# Altium schematic sheet S3_CHAIR_SPKR-AMP+SPK.SchDoc
size 431 x 279 mm; Revision: 1-0; SheetNumber: 4; SheetTotal: 4; CustomerName: PLASTIMOLD; ProjectName: Chairspeaker TI Receiver
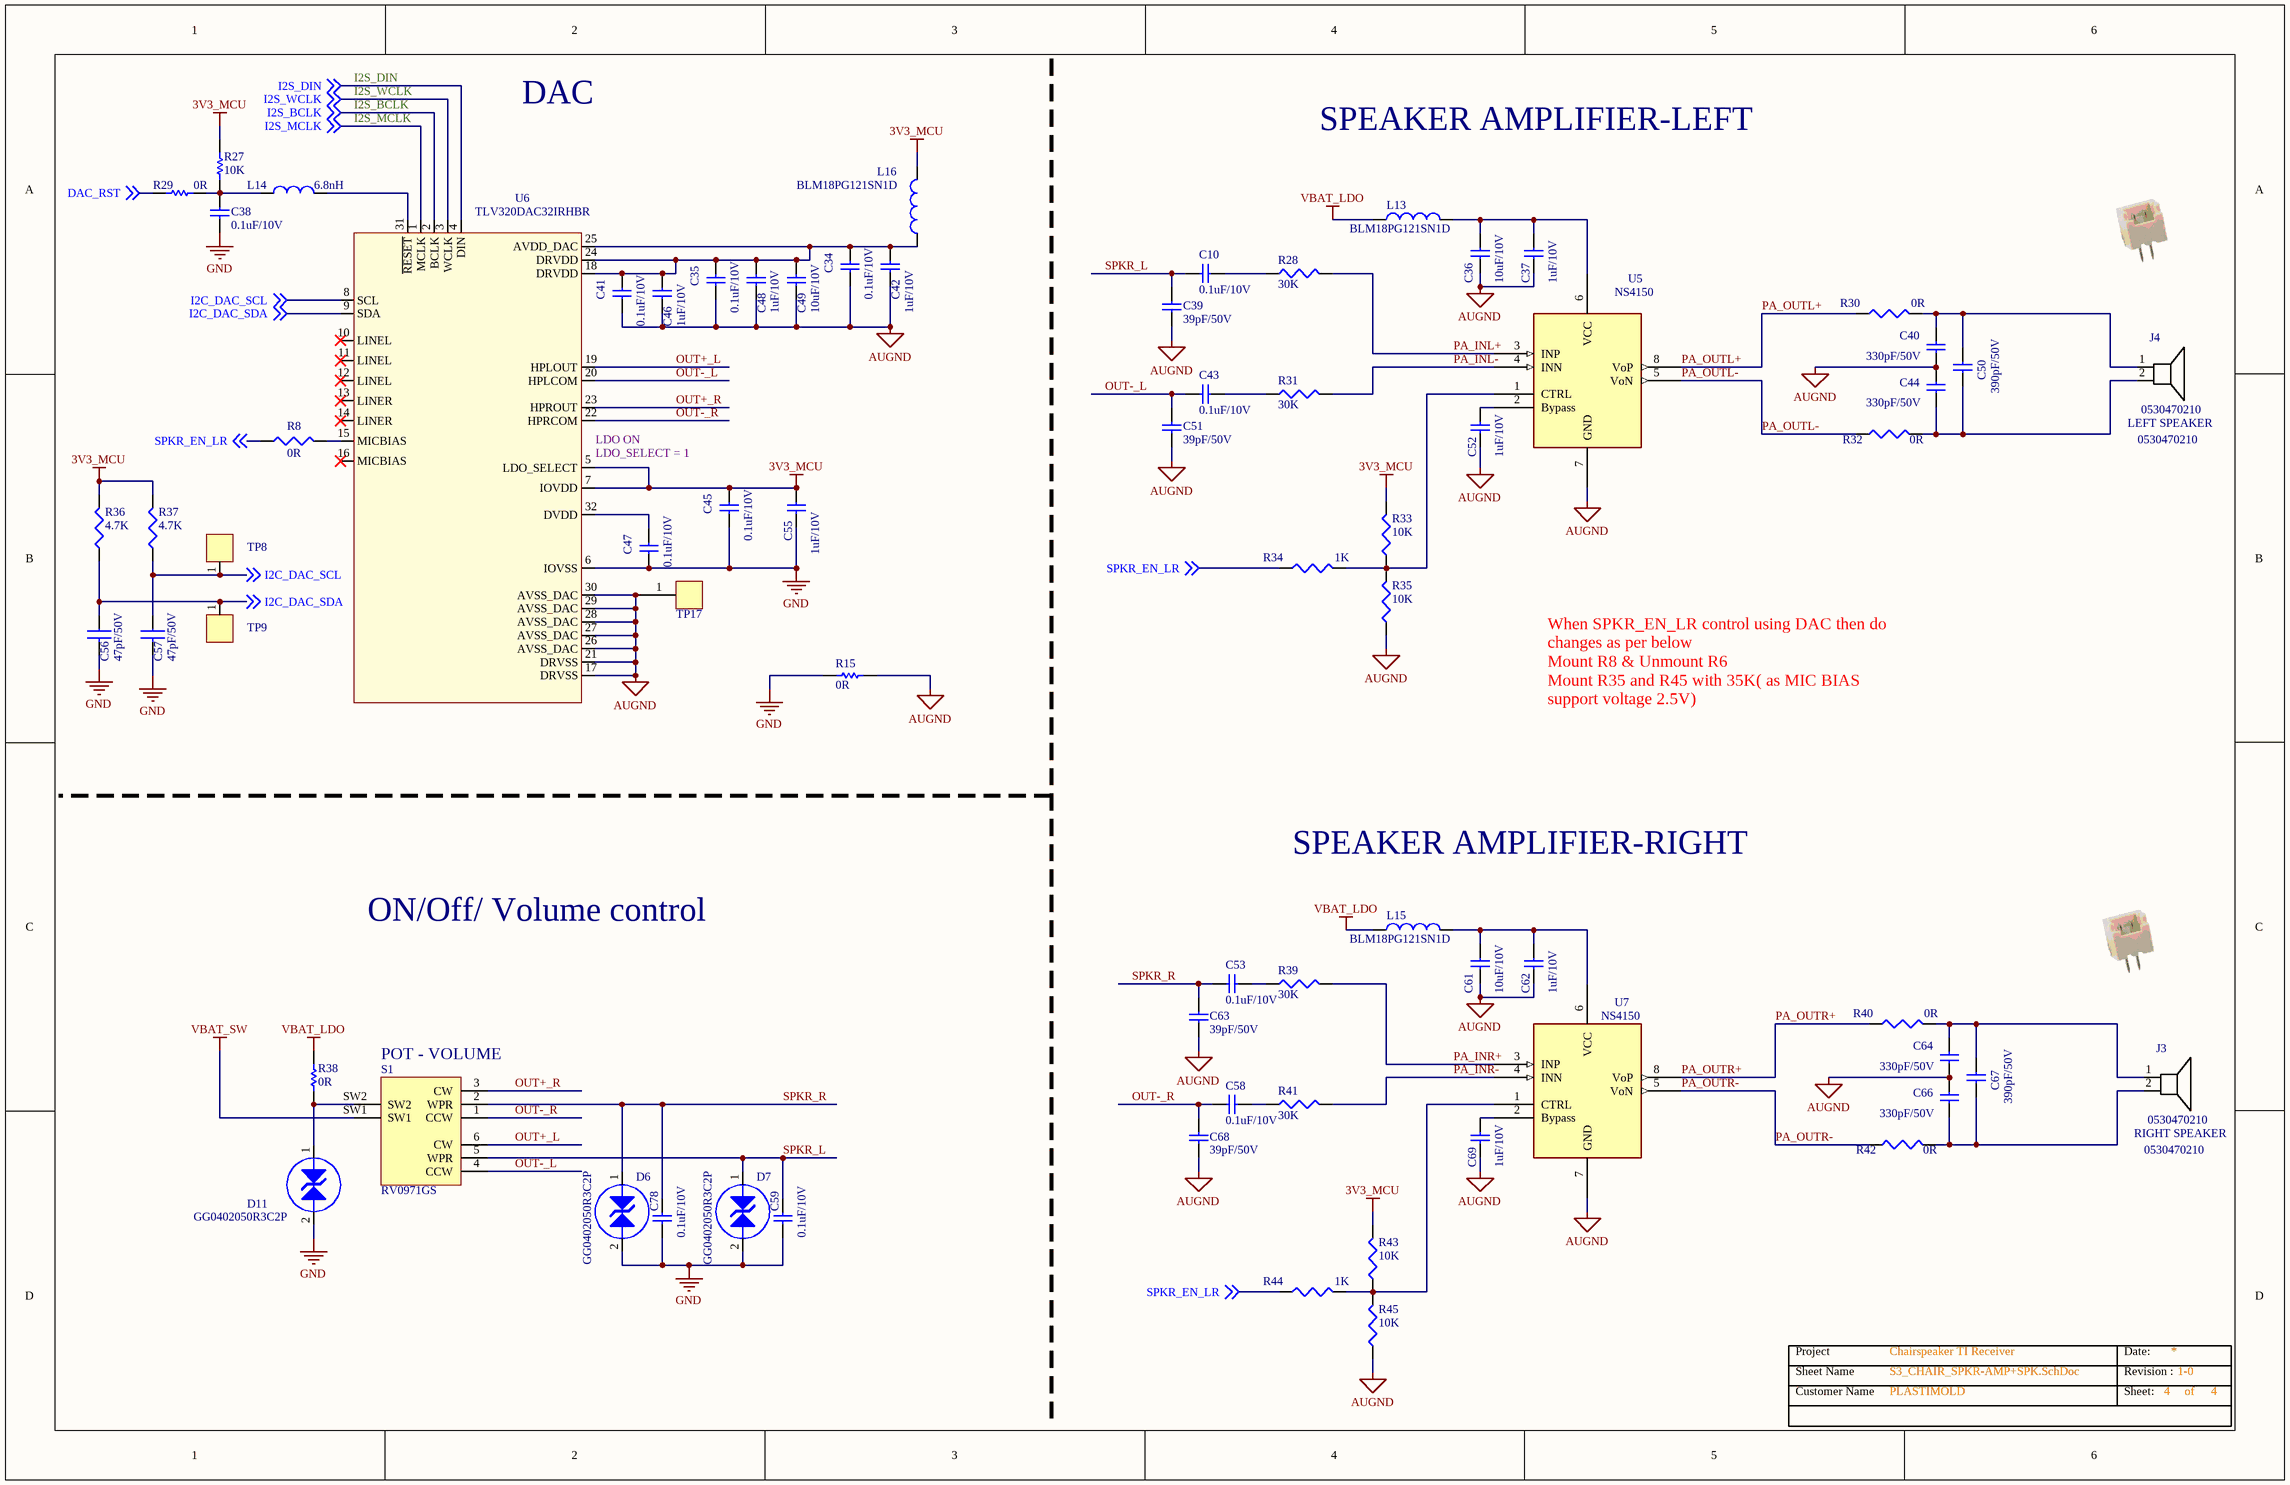
[diagram p0: S3_CHAIR_SPKR-AMP+SPK.SchDoc]

## Parts
C10  0.1uF/10V  [CAP_0402_(M1005)]
C34  0.1uF/10V  [CAP_0402_(M1005)]
C35  0.1uF/10V  [CAP_0402_(M1005)]
C36  10uF/10V  [CAP_0805_(M2012)]
C37  1uF/10V  [CAP_0402_(M1005)]
C38  0.1uF/10V  [CAP_0402_(M1005)]
C39  39pF/50V  [CAP_0402_(M1005)]
C40  330pF/50V  [CAP_0402_(M1005)]
C41  0.1uF/10V  [CAP_0402_(M1005)]
C42  1uF/10V  [CAP_0402_(M1005)]
C43  0.1uF/10V  [CAP_0402_(M1005)]
C44  330pF/50V  [CAP_0402_(M1005)]
C45  0.1uF/10V  [CAP_0402_(M1005)]
C46  1uF/10V  [CAP_0402_(M1005)]
C47  0.1uF/10V  [CAP_0402_(M1005)]
C48  1uF/10V  [CAP_0402_(M1005)]
C49  10uF/10V  [CAP_0805_(M2012)]
C50  390pF/50V  [CAP_0402_(M1005)]
C51  39pF/50V  [CAP_0402_(M1005)]
C52  1uF/10V  [CAP_0402_(M1005)]
C53  0.1uF/10V  [CAP_0402_(M1005)]
C55  1uF/10V  [CAP_0402_(M1005)]
C56  47pF/50V  [CAP_0402_(M1005)]
C57  47pF/50V  [CAP_0402_(M1005)]
C58  0.1uF/10V  [CAP_0402_(M1005)]
C59  0.1uF/10V  [CAP_0402_(M1005)]
C61  10uF/10V  [CAP_0805_(M2012)]
C62  1uF/10V  [CAP_0402_(M1005)]
C63  39pF/50V  [CAP_0402_(M1005)]
C64  330pF/50V  [CAP_0402_(M1005)]
C66  330pF/50V  [CAP_0402_(M1005)]
C67  390pF/50V  [CAP_0402_(M1005)]
C68  39pF/50V  [CAP_0402_(M1005)]
C69  1uF/10V  [CAP_0402_(M1005)]
C78  0.1uF/10V  [CAP_0402_(M1005)]
D6  GG0402050R3C2P  [TVS_0402_(M1005)_BI-DIRECTIONAL]
D7  GG0402050R3C2P  [TVS_0402_(M1005)_BI-DIRECTIONAL]
D11  GG0402050R3C2P  [TVS_0402_(M1005)_BI-DIRECTIONAL]
J3  0530470210  [0530470210]
J4  0530470210  [0530470210]
L13  value BLM18PG121SN1D  [IND_0603_(M1608)]  (hidden comment: BLM18PG181SN1D)
L14  6.8nH  [IND_0402_(M1005)]
L15  value BLM18PG121SN1D  [IND_0603_(M1608)]  (hidden comment: BLM18PG181SN1D)
L16  value BLM18PG121SN1D  [IND_0603_(M1608)]  (hidden comment: BLM18PG181SN1D)
R8  0R  [RES_0402_(M1005)]
R15  0R  [RES_0402_(M1005)]
R27  10K  [RES_0402_(M1005)]
R28  30K  [RES_0402_(M1005)]
R29  0R  [RES_0402_(M1005)]
R30  0R  [RES_0402_(M1005)]
R31  30K  [RES_0402_(M1005)]
R32  0R  [RES_0402_(M1005)]
R33  10K  [RES_0402_(M1005)]
R34  1K  [RES_0402_(M1005)]
R35  10K  [RES_0402_(M1005)]
R36  4.7K  [RES_0402_(M1005)]
R37  4.7K  [RES_0402_(M1005)]
R38  0R  [RES_0402_(M1005)]
R39  30K  [RES_0402_(M1005)]
R40  0R  [RES_0402_(M1005)]
R41  30K  [RES_0402_(M1005)]
R42  0R  [RES_0402_(M1005)]
R43  10K  [RES_0402_(M1005)]
R44  1K  [RES_0402_(M1005)]
R45  10K  [RES_0402_(M1005)]
S1  RV0971GS  [RV0971GS]
TP8  TP  [TestP SM 30MIL ROUND]  (value not drawn)  (no BOM)
TP9  TP  [TestP SM 30MIL ROUND]  (value not drawn)  (no BOM)
TP17  TP  [TestP SM 30MIL ROUND]  (value not drawn)  (no BOM)
U5  NS4150  [SOP-8]
U6  TLV320DAC32IRHBR  [VQFN32]
U7  NS4150  [SOP-8]

## Nets
3V3_MCU: C45.2 C55.2 L16.2 R27.1 R33.2 R36.2 R37.2 R43.2 U6.5(LDO_SELECT) U6.7(IOVDD)
AUGND: C34.1 C35.1 C36.1 C37.1 C39.1 C40.1 C41.1 C42.1 C44.2 C46.1 C48.1 C49.1 C51.1 C52.1 C61.1 C62.1 C63.1 C64.1 C66.2 C68.1 C69.1 R15.1 R35.1 R45.1 TP17.1 U5.7(GND) U6.17(DRVSS) U6.21(DRVSS) U6.26(AVSS_DAC) U6.27(AVSS_DAC) U6.28(AVSS_DAC) U6.29(AVSS_DAC) U6.30(AVSS_DAC) U7.7(GND)
GND: C38.1 C45.1 C47.1 C55.1 C56.2 C57.2 C59.1 C78.1 D6.2 D7.2 D11.2 R15.2 U6.6(IOVSS)
VBAT_LDO: L13.1 L15.1 R38.2
VBAT_SW: S1.SW1
DAC_RST: R29.1 ; off-sheet DAC_RST
I2C_DAC_SCL: C57.1 R37.1 TP8.1 U6.8(SCL) ; off-sheet I2C_DAC_SCL
I2C_DAC_SDA: C56.1 R36.1 TP9.1 U6.9(SDA) ; off-sheet I2C_DAC_SDA
I2S_BCLK: U6.2(BCLK) ; off-sheet I2S_BCLK
I2S_DIN: U6.4(DIN) ; off-sheet I2S_DIN
I2S_MCLK: U6.1(MCLK) ; off-sheet I2S_MCLK
I2S_WCLK: U6.3(WCLK) ; off-sheet I2S_WCLK
OUT+_L: S1.6(CW) U6.19(HPLOUT)
OUT+_R: S1.3(CW) U6.23(HPROUT)
OUT-_L: C43.1 C51.2 S1.4(CCW) U6.20(HPLCOM)
OUT-_R: C58.1 C68.2 S1.1(CCW) U6.22(HPRCOM)
PA_INL+: R28.1 U5.3(INP)
PA_INL-: R31.1 U5.4(INN)
PA_INR+: R39.1 U7.3(INP)
PA_INR-: R41.1 U7.4(INN)
PA_OUTL+: R30.1 U5.8(VoP)
PA_OUTL-: R32.1 U5.5(VoN)
PA_OUTR+: R40.1 U7.8(VoP)
PA_OUTR-: R42.1 U7.5(VoN)
SPKR_EN_LR: R8.1 R34.1 R44.1 ; off-sheet SPKR_EN_LR
SPKR_L: C10.1 C39.2 C59.2 D7.1 S1.5(WPR)
SPKR_R: C53.1 C63.2 C78.2 D6.1 S1.2(WPR)
NetC10_2: C10.2 R28.2
NetC34_2: C34.2 C35.2 C41.2 C42.2 C46.2 C48.2 C49.2 L16.1 U6.18(DRVDD) U6.24(DRVDD) U6.25(AVDD_DAC)
NetC36_2: C36.2 C37.2 L13.2 U5.6(VCC)
NetC38_2: C38.2 L14.1 R27.2 R29.2
NetC40_2: C40.2 C50.2 J4.1(POS) R30.2
NetC43_2: C43.2 R31.2
NetC44_1: C44.1 C50.1 J4.2(NEG) R32.2
NetC47_2: C47.2 U6.32(DVDD)
NetC52_2: C52.2 U5.2(Bypass)
NetC53_2: C53.2 R39.2
NetC58_2: C58.2 R41.2
NetC61_2: C61.2 C62.2 L15.2 U7.6(VCC)
NetC64_2: C64.2 C67.2 J3.1(POS) R40.2
NetC66_1: C66.1 C67.1 J3.2(NEG) R42.2
NetC69_2: C69.2 U7.2(Bypass)
NetD11_1: D11.1 R38.1 S1.SW2
NetL14_2: L14.2 U6.31(~{RESET})
NetR8_2: R8.2 U6.15(MICBIAS)
NetR33_1: R33.1 R34.2 R35.2 U5.1(CTRL)
NetR43_1: R43.1 R44.2 R45.2 U7.1(CTRL)

Not connected (* = marked no-connect by the designer): U6 10(LINEL)* 11(LINEL)* 12(LINEL)* 13(LINER)* 14(LINER)* 16(MICBIAS)*

## Notes on the sheet
- DAC
- SPEAKER AMPLIFIER-LEFT
- (near J4) LEFT SPEAKER
- (near U6) LDO ON
- (near U6) LDO_SELECT = 1
- When SPKR_EN_LR control using DAC then do changes as per below
  Mount R8 & Unmount R6
  Mount R35 and R45 with 35K( as MIC BIAS support voltage 2.5V)
- SPEAKER AMPLIFIER-RIGHT
- ON/Off/ Volume control
- (near S1) POT - VOLUME
- (near J3) RIGHT SPEAKER
- Sheet Name
- Project
- Date:
- Revision :
- Customer Name
- Sheet:
- of

## Library data of the parts
C10 C34 C35 C38 C41 C43 C45 C47 C53 C58 C59 C78 = CAP_1: =Description1; Manufacturer 1: Yageo; Manufacturer Part Number 1: CC0402KRX7R6BB104; Description1: CAP CER 0.1UF 10V X7R 0402; Cross Allowed: YES; Value: 0.1uF/10V
C36 C49 C61 = CAP_10uF/16V_0805: =Description1; Manufacturer 1: Samsung Electro-Mechanics; Manufacturer Part Number 1: CL21A106KPFNNNG; Description1: CAP CER 10UF 10V X5R 0805; Cross Allowed: YES; Value: 10uF/10V
C37 C42 C46 C48 C52 C55 C62 C69 = CAP_1uF/16v (10%): =Description1; Manufacturer 1: Murata Electronics; Manufacturer Part Number 1: GRM155R61A105KE15D; Description1: CAP CER 1UF 10V X5R 0402; Cross Allowed: YES; Value: 1uF/10V
C39 C51 C63 C68 = CAP_39pF/50V (±5%): =Description1; Manufacturer 1: Samsung Electro-Mechanics; Manufacturer Part Number 1: CL05C390JB5NNNC; Description1: CAP CER 39PF 50V C0G/NP0 0402; Cross Allowed: YES; Value: 39pF/50V
C40 C44 C64 C66 = CAP_330pF/50V (5%): =Description1; Manufacturer 1: Walsin Technology Corporation; Manufacturer Part Number 1: 0402N331J500CT; Description1: CAP CER 330PF 50V C0G/NP0 0402; Cross Allowed: YES; Value: 330pF/50V
C50 C67 = CAP_390pF/50V (5%): =Description1; Manufacturer 1: AVX Corporation; Manufacturer Part Number 1: 04025C391JAT2A; Description1: CAP CER 390PF 50V X7R 0402; Cross Allowed: YES; Value: 390pF/50V
C56 C57 = CAP NP: =Description1; Manufacturer 1: Yageo; Manufacturer Part Number 1: CC0402JRNPO9BN470; Description1: CAP CER 47PF 50V C0G/NPO 0402; Cross Allowed: YES; VALUE: 47pF/50V
D6 D7 D11 = TVS-DIODE: =Description1; Manufacturer 1: AVX Corporation; Description1: TVS DIODE 5V 15.5V 0402; Cross Allowed: YES; Manufacturer Part Number 1: GG0402050R3C2P; VALUE: GG0402050R3C2P
J3 J4 = HDR1X2_speaker: =Description1; Manufacturer 1: Molex; Description1: CONN HEADER VERT 2POS 1.25MM; Cross Allowed: YES; Value: 0530470210; Manufacturer Part Number 1: 0530470210
L13 L15 L16 = BLM18PG181SN1D: =Description1; Manufacturer 1: Murata; Description1: FERRITE BEAD 120 OHM 0603 1LN; Cross Allowed: YES; Manufacturer Part Number 1: BLM18PG121SN1D
L14 = IND: =Description1; Manufacturer Part Number 1: HK10056N8J-T; Manufacturer 1: Taiyo Yuden; Description1: FIXED IND 6.8NH 430MA 250 MOHM; Cross Allowed: YES; Value: 6.8nH
R8 R30 R32 R40 R42 = RES_0R: =Description1; Manufacturer 1: Panasonic Electronic Components; Manufacturer Part Number 1: ERJ-2GE0R00X; Description1: RES 0R JUMPER 1/10W 0402; Cross Allowed: YES; Value: 0R
R15 R29 R38 = RC1206JR-070RL: =Description1; Manufacturer 1: Panasonic Electronic Components; Manufacturer Part Number 1: ERJ-2GE0R00X; Description1: RES 0R JUMPER 1/10W 0402; Cross Allowed: YES; Value: 0R
R27 = RESISTOR: =Description1; Manufacturer 1: Stackpole Electronics Inc; Manufacturer Part Number 1: RMCF0402FT10K0; Description1: RES 10K OHM 1% 1/16W 0402; Cross Allowed: YES; Value: 10K
R28 R31 R39 R41 = RES_30K_1%: =Description1; Manufacturer 1: Panasonic Electronic Components; Manufacturer Part Number 1: ERJ-2RKF3002X; Description1: RES SMD 30K OHM 1% 1/10W 0402; Cross Allowed: YES; Value: 30K
R33 R35 R43 R45 = RES_10K_1%: =Description1; Manufacturer 1: Stackpole Electronics Inc; Manufacturer Part Number 1: RMCF0402FT10K0; Description1: RES 10K OHM 1% 1/16W 0402; Cross Allowed: YES; Value: 10K
R34 R44 = RES_0R: =Description1; Manufacturer 1: Stackpole Electronics Inc; Manufacturer Part Number 1: RMCF0402FT1K00; Description1: RES 1K OHM 1% 1/16W 0402; Cross Allowed: YES; Value: 1K
R36 R37 = RES: =Description1; Manufacturer 1: Stackpole Electronics Inc; Manufacturer Part Number 1: RMCF0402FT4K70; Description1: RES 4.7K OHM 1% 1/16W 0402; Cross Allowed: YES; VALUE: 4.7K
S1 = RV0971GS: =Description1; Description1: Potentiometer; Cross Allowed: YES; Manufacturer Part Number 1: RV0971GS; Value: RV0971GS
TP8 TP9 TP17 = TP: =Description1; Description1: NA; Value: NA; Cross Allowed: YES; Manufacturer 1: NA; Manufacturer Part Number 1: NA
U5 = NS4150: =Description1; Manufacturer 1: NSIWAY; Description1: Low EMI,Filterless,3W Mono Class D Audio Amplifier; Cross Allowed: NO; Value: NS4150; Manufacturer Part Number 1: NS4150
U6 = TLV320DAC32: =Description1; Manufacturer 1: Texas Instruments; Cross Allowed: NO; Description1: IC DAC 24BIT 96K 32VQFN; Value: TLV320DAC32IRHBR; Manufacturer Part Number 1: TLV320DAC32IRHBR
U7 = NS4150: =Description1; Manufacturer 1: NSIWAY; Description1: Low EMI,Filterless,3W Mono Class D Audio Amplifier,SOP-8; Cross Allowed: NO; Value: NS4150; Manufacturer Part Number 1: NS4150